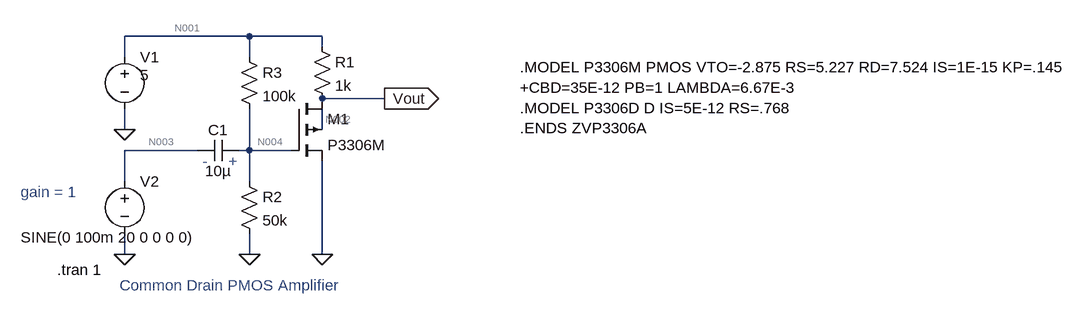
[diagram p0: schematic Draft2.asc]
Draft2.asc, the LTspice schematic file:
Version 4
SHEET 1 1580 1676
WIRE 272 0 80 0
WIRE 384 0 272 0
WIRE 384 16 384 0
WIRE 80 32 80 0
WIRE 272 32 272 0
WIRE 480 96 384 96
WIRE 80 144 80 112
WIRE 384 144 384 112
WIRE 192 176 80 176
WIRE 272 176 272 112
WIRE 272 176 256 176
WIRE 336 176 272 176
WIRE 80 224 80 176
WIRE 272 224 272 176
WIRE 80 336 80 304
WIRE 272 336 272 304
WIRE 384 336 384 192
FLAG 80 144 0
FLAG 272 336 0
FLAG 384 336 0
FLAG 480 96 Vout
IOPIN 480 96 Out
FLAG 80 336 0
SYMBOL voltage 80 16 R0
WINDOW 3 24 44 Left 2
WINDOW 123 0 0 Left 0
WINDOW 39 0 0 Left 0
SYMATTR Value 5
SYMATTR InstName V1
SYMBOL res 256 208 R0
SYMATTR InstName R2
SYMATTR Value 50k
SYMBOL res 256 16 R0
SYMATTR InstName R3
SYMATTR Value 100k
SYMBOL cap 256 160 R90
WINDOW 0 0 32 VBottom 2
WINDOW 3 32 32 VTop 2
SYMATTR InstName C1
SYMATTR Value 10µ
SYMBOL voltage 80 208 R0
WINDOW 3 -160 102 Left 2
WINDOW 123 0 0 Left 0
WINDOW 39 0 0 Left 0
SYMATTR Value SINE(0 100m 20 0 0 0 0)
SYMATTR InstName V2
SYMBOL res 368 0 R0
SYMATTR InstName R1
SYMATTR Value 1k
SYMBOL pmos4 336 96 R0
SYMATTR InstName M1
SYMATTR Value P3306M
TEXT 240 192 Left 2 ;+
TEXT 200 192 Left 2 ;-
TEXT -24 360 Left 2 !.tran 1
TEXT -80 240 Left 2 ;gain = 1
TEXT 72 384 Left 2 ;Common Drain PMOS Amplifier
TEXT 688 48 Left 2 !.MODEL P3306M PMOS VTO=-2.875 RS=5.227 RD=7.524 IS=1E-15 KP=.145\n+CBD=35E-12 PB=1 LAMBDA=6.67E-3\n.MODEL P3306D D IS=5E-12 RS=.768\n.ENDS ZVP3306A

The netlist it stands for:
* Draft2.asc
V1 N001 0 5
R2 N004 0 50k
R3 N001 N004 100k
C1 N004 N003 10µ
V2 N003 0 SINE(0 100m 20 0 0 0 0)
R1 N001 Vout 1k
M1 Vout N004 0 N002 P3306M
.model NMOS NMOS
.model PMOS PMOS
.lib standard.mos
* +
* -
.tran 1
* gain = 1
* Common Drain PMOS Amplifier
.MODEL P3306M PMOS VTO=-2.875 RS=5.227 RD=7.524 IS=1E-15 KP=.145
+CBD=35E-12 PB=1 LAMBDA=6.67E-3
.MODEL P3306D D IS=5E-12 RS=.768
.ENDS ZVP3306A
.backanno
.end

* Results of the author's LTspice run, read from the files saved beside the schematic
* Operating Point, zero values left out:
*   V(n001) = 5 V
*   V(n004) = 1.667 V
*   V(vout) = 4.616 V
*   V(n002) = 4.379 V
*   Id(M1) = 383.8 µA
*   Ib(M1) = -4.415 pA
*   Is(M1) = -383.8 µA
*   I(R1) = 383.8 µA
*   I(R3) = 33.33 µA
*   I(R2) = 33.33 µA
*   I(V1) = -417.1 µA
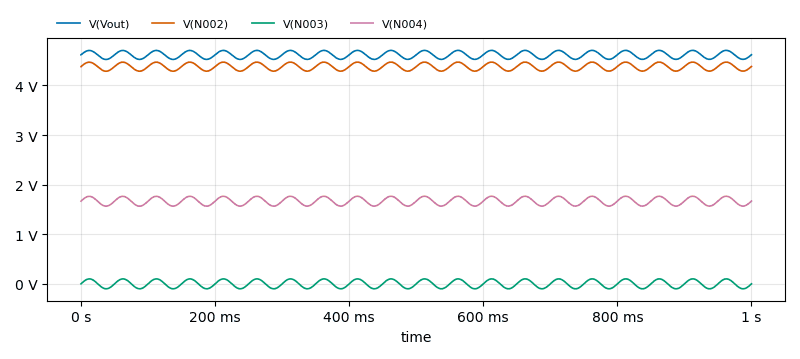
[diagram p1: Transient Analysis of Draft2.asc, plotted from the saved traces]
* Transient Analysis, 1 run:
*   V(Vout): min 4.523 V, max 4.706 V, average 4.615 V, rms 4.616 V, last 4.618 V
*   V(N002): min 4.286 V, max 4.47 V, average 4.378 V, rms 4.379 V, last 4.381 V
*   V(N003): min -100 mV, max 100 mV, average 38.68 nV, rms 70.74 mV, last 0 V
*   V(N004): min 1.565 V, max 1.766 V, average 1.666 V, rms 1.667 V, last 1.669 V